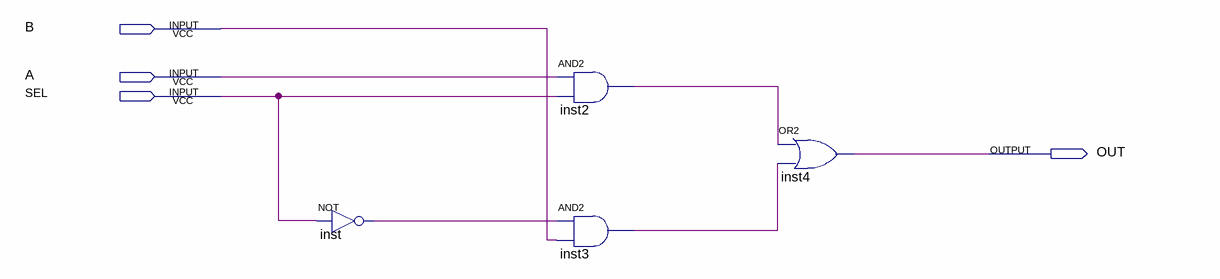
[diagram p0: schematic sheet]
// Quartus schematic Two_To_One_Mux.bdf as structural Verilog: 4 symbols, 4 pins
module Two_To_One_Mux (
  input  B,
  input  A,
  input  SEL,
  output OUT
);

  wire inst2_out, inst3_out, inst_out;

  not inst (inst_out, SEL);
  and inst2 (inst2_out, A, SEL);
  and inst3 (inst3_out, inst_out, B);
  or inst4 (OUT, inst2_out, inst3_out);
endmodule
